# Altium schematic sheet Motion Control Inputs.SchDoc
size A4; SheetNumber: 1; SheetTotal: 2
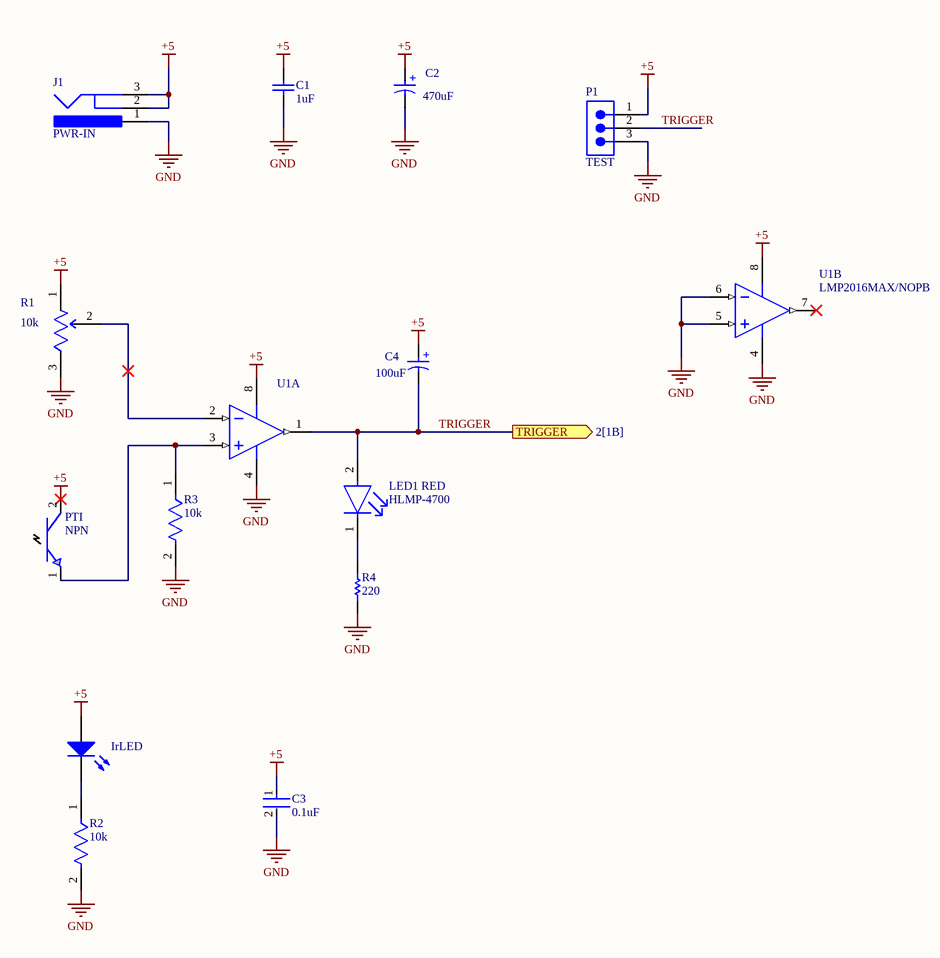
[diagram p0: Motion Control Inputs.SchDoc]

## Parts
C1  1uF  [CAPC1206(3216)130_L]
C2  470uF  [WCAP-ASLL_D8H10.5]
C3  0.1uF  [FP-GRM21B-0_1-MFG]
C4  100uF  [WCAP-AS5H_D6.3H5.5]
IrLED  (no value)  [EVRL-IR333C]
J1  PWR-IN  [KYCN-KLDX-0202-A_V]
LED1_RED  HLMP-4700  [FP-HLMP-4700-MFG]
P1  TEST  [SMTC-TSW-103-07-X-S]
PTI  NPN  [PhotoTr_PT3347-6B]
R1  10k  [FP-3296W-MFG]
R2  10k  [FP-CRGCQ1206-IPC_C]
R3  10k  [FP-CRGCQ1206-IPC_C]
R4  220  [RESC3216X60X45ML10T20]
U1  (no value)  [M08A_M]  (parts A,B of 2)

## Ports
TRIGGER (out, see 2[1B])

## Nets
+5: C1.2 C2.1(P) C3.1 C4.1(P) IrLED.1(A) J1.2 J1.3 P1.1 PTI.2(C) R1.1(CCW) U1.8(V+)
GND: C1.1 C2.2(N) C3.2 J1.1 P1.3 R1.3(CW) R2.2 R3.2 R4.2 U1.4(V-) U1.5(IN2+) U1.6(IN2-)
TRIGGER: C4.2(N) LED1_RED.2(A) P1.2 U1.1(OUT1) ; port TRIGGER
NetIrLED_2: IrLED.2(K) R2.1
NetLED1_RED_1: LED1_RED.1(C) R4.1
NetPTI_1: PTI.1(E) R3.1 U1.3(IN1+)
NetR1_2: R1.2(WIPER) U1.2(IN1-)

Not connected (* = marked no-connect by the designer): U1 7(OUT2)*

## Notes on the sheet
- (in symbol CAP POL 100uF 6.3V) +
- (in symbol CAP POL 470uF 6.3V) +

## Library data of the parts
C1 = CAP 1uF 10V: CAP 1uF 10V ±5% 1206 (3216 Metric) Thickness 1.3mm SMD; Case-EIA: 1206; Tolerance: Â±5%; Case-Metric: 3216; Value: 1uF; Technology: SMT; Rated Voltage: 10 V; Max Thickness: 1.3 mm
C2 = CAP POL 470uF 6.3V: WCAP-ASLL Aluminum Electrolytic Capacitors; Capacitance: 470µF; Polarity: Polar; Impedance: 170mΩ; Voltage Rating (DC): 6.3V; Life (Hours): 5000hours; Leakage Current: 29.61µA; Ripple Current (AC): 500mA; Insulation Resistance: 212.766kΩ; ESR (Equivalent Series Resistance): 124.302mΩ; Tolerance: 20%; Case/Package: Radial; Max Operating Temperature: 105°C; Mount: Surface Mount; Min Operating Temperature: -55°C; Voltage Rating: 6.3V; Length: 10.5mm; RoHS: Compliant; Height: 10.5mm; Height - Seated (Max): 10.4902mm; Ripple Current: 500mA; REACH SVHC: Unknown; Diameter: 8mm
C3 = CAP 0.1uF 10V 0805: Chip Multilayer Ceramic Capacitors for General Purpose, 0805, 0.10uF, U2J, -750ppm/°C, 5%, 10V; Capacitance: 100nF; Dielectric: U2J; Voltage Rating (DC): 10V; Thickness: 1.25mm; Width: 1.25mm; Length: 2mm; Case/Package: 0805; Tolerance: 5%
C4 = CAP POL 100uF 6.3V: WCAP-AS5H Aluminum Electrolytic Capacitors; Insulation Resistance: 1MΩ; Capacitance: 100µF; Voltage Rating: 6.3V; Life (Hours): 5000hours; Ripple Current: 60mA; Polarity: Polar; Tolerance: 20%; Leakage Current: 6.3µA; RoHS: Compliant; Max Operating Temperature: 105°C; Length: 5.5mm; Height - Seated (Max): 5.5118mm; REACH SVHC: Unknown; Mount: Surface Mount; Voltage Rating (DC): 6.3V; Ripple Current (AC): 60mA; Width: 6.6mm; Height: 5.5mm; Diameter: 6.3mm; Case/Package: Radial; Min Operating Temperature: -40°C
IrLED = IR Emitter 5mm: Infrared LED, 1.2 V, -40 to 85 degC, 2-Pin Radial, RoHS, Bulk; Manufacturer: Everlight Electronics; Viewing Angle: 40deg; Power Rating: 150mW; Maximum Forward Current: 1A; Brand: Everlight; Operating Voltage: 1.2V; Wavelength: 940nm; Radiant Intensity: 12mW/sr; Lens Shape: Dome; Forward Current: 20mA; Datasheet URL: http://www.everlight.com/file/ProductFile/201407061521223111.pdf; Manufacturer URL: http://www.everlight.com/; Mounting Style: ThroughHole; Factory Pack Quantity: 500; RoHS: Details; Illumination Color: Infrared; Package / Case: T-13/4; Forward Voltage: 1.2V; Minimum Operating Temperature: -40C; Product Category: InfraredEmitters; Datasheet Version: May-13; Maximum Operating Temperature: +85C
J1 = Conn DC Power Jack 2mm: DC Power Jack, 24 V, 3.5 A, -25 to 85 degC, 3-Pin THD, RoHS; Manufacturer: Kycon; Voltage Rating: 24 V; Current Rating: 3.5 A; Height: 10.8 mm; Length: 9.2 mm; Pins: 2; Housing Material: PBT; Connector Type: Power; ComponentLink2URL: http://www.kycon.com/Pub_Eng_Draw/KLDX-0202-X.PDF; PackageDescription: 3-Pin Through Hole Device, Body 14.5 x 9 mm; Max Operating Temperature: 85 degC; Min Operating Temperature: -25 degC; PackageReference: KLDX-0202-A; Contact Gender: Female; Package Quantity: 500; Mount: Through Hole; Colour: Black; Contact Plating: Tin; DatasheetVersion: Rev. D3, 06/2013; ComponentLink2Description: Datasheet; RoHSCompliant: true; Mounting Technology: Through Hole; ComponentLink1Description: Manufacturer URL; Contact Material: Brass; ComponentLink1URL: http://www.kycon.com/
LED1_RED = LED Red 5mm: LED RED DIFFUSED T-1 3/4 T/H; Manufacturer: Broadcom; Luminous Intensity: 2.3mcd; Peak Emmision Wavelength: 635nm; Forward Voltage: 1.7V; Viewing Angle: 50°; Led Orientation: Straight; Reverse Voltage: 5V; Forward Current: 2mA; Power Dissipation: 14mW; Wavelength: 626nm; Digikey Description: LED RED DIFFUSED T-1 3/4 T/H; Device Class L3: unset; Temperature Range Low: -40°C; Temperature Range High: +100°C; RoHS: TRUE; Package: HLMP-4700; Octopart: https://octopart.com/hlmp-4700-broadcom-71130526; Automotive: No; ComponentLink2URL: https://docs.broadcom.com/docs/AV02-1557EN; Colour: Red; Temperature: -40°C to +100°C; Lead Free: Yes; Category: Diode; ComponentLink2Description: Datasheet; Manufacturer Part Number: HLMP-4700; Device Class L1: Optoelectronics; Device Class L2: LEDs; Mouser Description: LED; Red; 2.3mcd; 0.24In.Dia.; T-1-3/4; 500mA; 1.7V; 635nm; 50deg; 5V; 24mW; -55degC;
P1 = Header 3POS 0.1" TH Single Row: 0.025" SQ Post Header, Through-hole, Vertical, -55 to 125 degC, 2.54 mm Pitch, 3-Pin, Male, RoHS; Manufacturer: Samtec; PartNumber: TSW-103-07-F-S; Pitch: 2.54 mm; DatasheetVersion: F-214; ComponentLink1Description: Manufacturer URL; ComponentLink3URL: http://www.samtec.com/documents/webfiles/cpdf/TSW-XXX-XX-XXX-X-XX-XXX-MKT.pdf; Mounting Technology: Through-hole; PackageDescription: .025[0.64] SQ. Post Terminal Strip Assembly; Temperature Range: -55 to 125 degC; ComponentLink3Description: Package Specification; Orientation: Vertical; RoHS: True; PackageVersion: DM, 8/1988; ComponentLink2Description: Datasheet; ComponentLink1URL: http://www.samtec.com; ComponentLink2URL: http://www.samtec.com/documents/webfiles/pdf/TSW_TH.PDF; PackageReference: TSW-103-07-X-S
PTI = Phototransistor: iber Optic Transceivers; PT334-6B; EVERLIGHT; 2; 940 nm; Through Hole; Yes; Manufacturer: Everlight; Manufacturer Part Number: PT334-6B
R1 = 10K Trimmer: TRIMMER 10K OHM 0.5W PC PIN TOP; Resistance: 10kR; Temperature Coefficient: 100ppm/°C; Power Rating: 500mW; Tolerance: 10%; Number of Turns: 25; Width: 0.19inch; Termination: Pin; Radiation Hardening: No; Contact Plating: Tin; Composition: Cermet; Length: 9.53mm; Height: 0.395inch; Depth: 4.83mm; REACH SVHC: No SVHC; Weight: 0.03oz; Min Operating Temperature: -55°C; Military Standard: Not; Max Operating Temperature: 125°C; Packaging: Tape and Reel; Package Quantity: 1; Taper: Linear; Max Power Dissipation: 500mW; Mount: Through Hole
R2 R3 = Res 10K 1/4W SMT: CRGCQ1206 10KΩ 0.25W 1% ±100ppm/°C 200V; Manufacturer: TE Connectivity; Manufacturer Part Number: CRGCQ1206F10K; Tolerance: 0.01; Automotive Grade: Grade 913; Value: 10KΩ; Automotive: Yes; Temperature: -55°C to +155°C; RoHS: TRUE; Series: CRGCQ; Lead Free: Yes; Device Class L3: Chip SMD Resistors; Package: CRGCQ1206; ComponentLink2URL: https://www.te.com/commerce/DocumentDelivery/DDEController?Action=showdoc&DocId=Data+Sheet%7F1773204-3%7F1%7Fpdf%7FEnglish%7FENG_DS_1773204-3_1.pdf%7F4-2176347-922; Ipc Land Pattern Name: RESC310155X55; Composition: Thick Film; Voltage Rating: 200V; Device Class L1: Passive Components; Temperature Range Low: -55°C; Resistance: 10KΩ; Height: 0.65mm; Power Rating: 0.25W; Device Class L2: Resistors; Temperature Range High: +155°C; Octopart: https://octopart.com/crgcq1206f10k-te+connectivity-91018244; Ambient Temperature Range High: +70°C; ComponentLink2Description: Datasheet; Temperature Coefficient: ±100ppm/°C; Category: Res
R4 = Res 220 Ohm 1/4W SMT: Manufacturer: Vishay Dale; Part Number: CRCW1206220RFKEA
U1 = OPAMP: High Precision, Rail-to-Rail Output Operational Amplifier, 8-pin Narrow SOIC, Pb-Free; Manufacturer: National Semiconductor; PowerWise: N; PackageTopMarking: NSZXTT*LMP20*16MA; CompType: Amplifiers; PackageVersion: revM, May-2009; PackageDescription: SOIC Narrow, 4.9 x 3.9 x 1.45mm, 8 Lead, 1.27mm Pitch; ComponentLink1URL: http://www.national.com/ds/LM/LMP2016.pdf; PackageReference: M08A; Code_JEDEC: MS-012-AA; Code_IPC: SOIC127P600-8; RoHS: Y; ComponentLink1Description: LMP2016 Datasheet; PinCount: 8; RevisionNote: Component URLs added; DatasheetVersion: Jan-2010; ComponentLink3URL: http://www.national.com/packaging/folders/m08a.html; ComponentLink2URL: http://www.national.com/pf/LM/LMP2016.html; ComponentLink3Description: M08A Package Page; ComponentLink2Description: LMP2016 Web Page